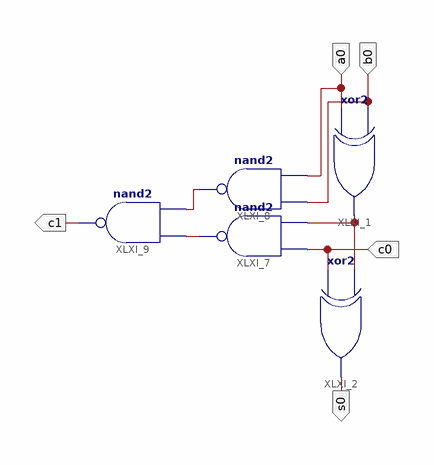
[diagram p0: schematic sheet 1]
// Xilinx ISE schematic lab7fa.sch (xa9500xl) as structural Verilog: 5 symbols, 5 ports
module lab7fa (
  input  c0,
  input  a0,
  input  b0,
  output s0,
  output c1
);

  wire XLXN_29, XLXN_30, XLXN_56;

  xor XLXI_1 (XLXN_56, a0, b0);
  xor XLXI_2 (s0, c0, XLXN_56);
  nand XLXI_7 (XLXN_30, XLXN_56, c0);
  nand XLXI_8 (XLXN_29, a0, b0);
  nand XLXI_9 (c1, XLXN_29, XLXN_30);
endmodule
